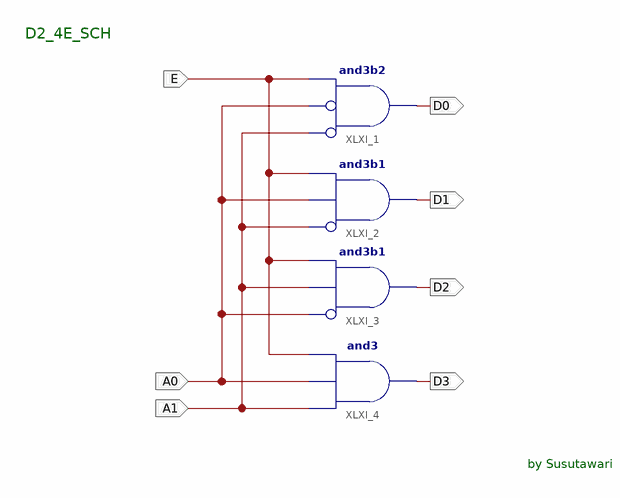
[diagram p0: schematic sheet 1]
// Xilinx ISE schematic D2_4E_SCH.sch (spartan3a) as structural Verilog: 4 symbols, 7 ports
module D2_4E_SCH (
  input  E,
  input  A1,
  input  A0,
  output D0,
  output D1,
  output D2,
  output D3
);

  and XLXI_1 (D0, ~A1, ~A0, E);  // and3b2
  and XLXI_2 (D1, ~A1, A0, E);  // and3b1
  and XLXI_3 (D2, ~A0, A1, E);  // and3b1
  and XLXI_4 (D3, A1, A0, E);

  // Notes on the sheet:
  //   D2_4E_SCH
  //   by Susutawari
endmodule
